# EAGLE design RTFM (EAGLE 9.3.2)
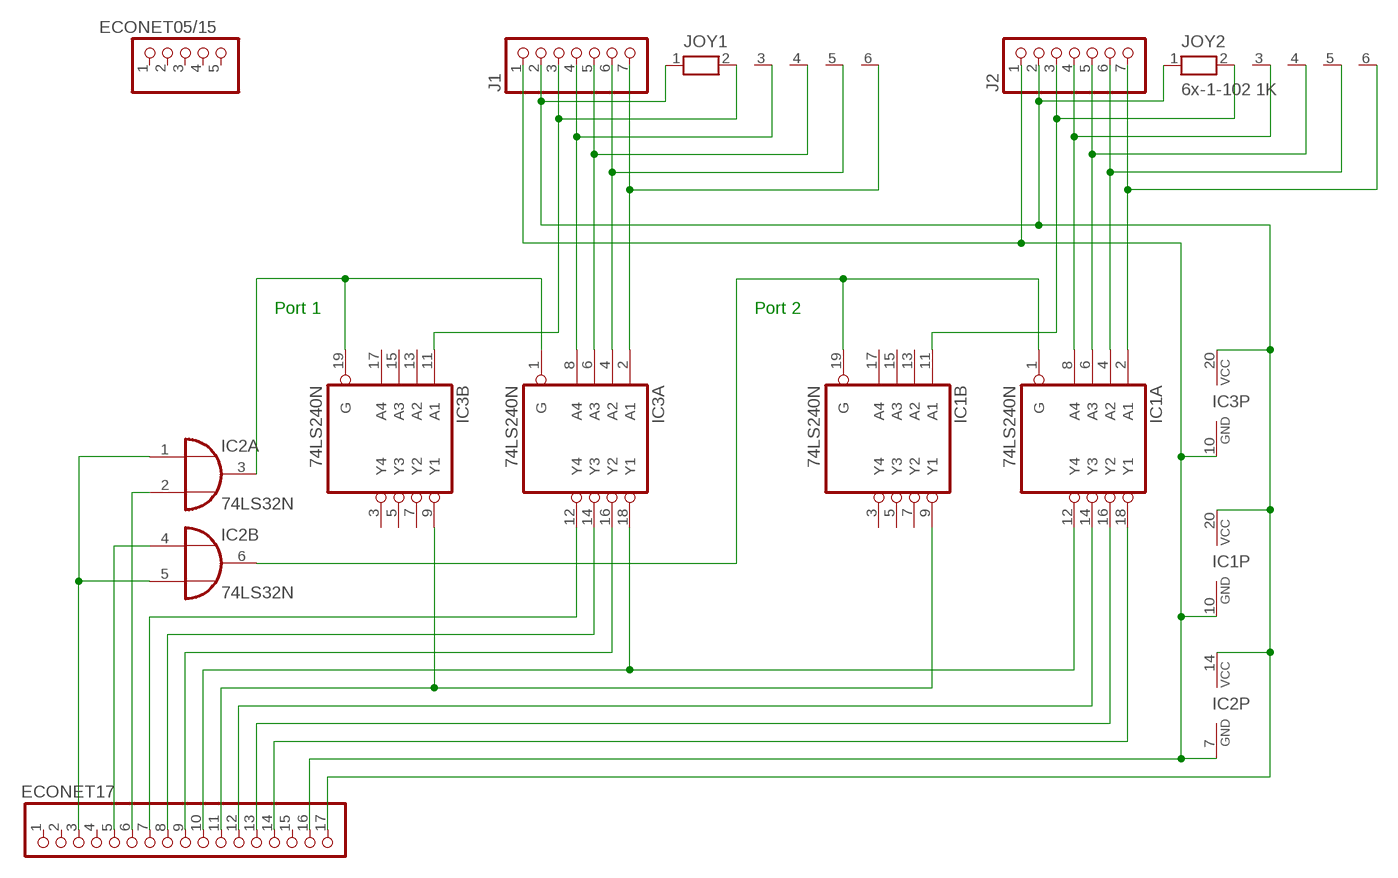
[diagram p0: schematic, sheet 1]

## Parts
ECONET05/15  PINHD-1X5  [1X05]
ECONET17  PINHD-1X17  [1X17]
IC1  74LS240N  [DIL20]
IC2  74LS32N  [DIL14]
IC3  74LS240N  [DIL20]
J1  PINHD-1X7  [1X07]
J2  PINHD-1X7  [1X07]
JOY1  6x-1-102 1K  RN05  [RN-6]
JOY2  6x-1-102 1K  RN05  [RN-6]

## Nets
N$1: ECONET17.3 IC2.1(A:I0) IC2.5(B:I1)
N$2: ECONET17.5 IC2.4(B:I0)
N$3: ECONET17.6 IC2.2(A:I1)
N$4: IC1.1(A:G) IC1.19(B:G) IC2.6(B:O)
N$5: ECONET17.16 IC1.10(P:GND) IC2.7(P:GND) IC3.10(P:GND) J1.1 J2.1
N$6: ECONET17.7 IC3.12(A:Y4)
N$7: ECONET17.8 IC3.14(A:Y3)
N$8: ECONET17.9 IC3.16(A:Y2)
N$9: ECONET17.10 IC1.12(A:Y4) IC3.18(A:Y1)
N$10: ECONET17.11 IC1.9(B:Y1) IC3.9(B:Y1)
N$11: ECONET17.12 IC1.14(A:Y3)
N$12: ECONET17.13 IC1.16(A:Y2)
N$13: ECONET17.14 IC1.18(A:Y1)
N$14: ECONET17.17 IC1.20(P:VCC) IC2.14(P:VCC) IC3.20(P:VCC) J1.2 J2.2 JOY1.1 JOY2.1
N$16: IC3.4(A:A2) J1.6 JOY1.5
N$17: IC3.6(A:A3) J1.5 JOY1.4
N$18: IC3.8(A:A4) J1.4 JOY1.3
N$19: IC3.2(A:A1) J1.7 JOY1.6
N$20: IC1.2(A:A1) J2.7 JOY2.6
N$21: IC1.4(A:A2) J2.6 JOY2.5
N$22: IC1.6(A:A3) J2.5 JOY2.4
N$23: IC1.8(A:A4) J2.4 JOY2.3
N$24: IC1.11(B:A1) J2.3 JOY2.2
N$25: IC2.3(A:O) IC3.1(A:G) IC3.19(B:G)
N$32: IC3.11(B:A1) J1.3 JOY1.2
Unconnected: ECONET05/15.1 ECONET05/15.2 ECONET05/15.3 ECONET05/15.4 ECONET05/15.5 ECONET17.1 ECONET17.2 ECONET17.4 ECONET17.15 IC1.3(B:Y4) IC1.5(B:Y3) IC1.7(B:Y2) IC1.13(B:A2) IC1.15(B:A3) IC1.17(B:A4) IC2.8(C:O) IC2.9(C:I0) IC2.10(C:I1) IC2.11(D:O) IC2.12(D:I0) IC2.13(D:I1) IC3.3(B:Y4) IC3.5(B:Y3) IC3.7(B:Y2) IC3.13(B:A2) IC3.15(B:A3) IC3.17(B:A4)

## Notes on the sheet
- Port 1 | Port 2

## Library data of the parts
ECONET05/15 = pinhead:PINHD-1X5: PIN HEADER
ECONET17 = pinhead:PINHD-1X17: PIN HEADER
IC1 IC3 = 74xx-eu:74*240: Octal BUFFER and LINE DRIVER, 3-state
IC2 = 74xx-eu:74*32: Quad 2-input OR gate
J1 J2 = pinhead:PINHD-1X7: PIN HEADER
JOY1 JOY2 = resistor-net:RN05: RESISTOR NETWORK; OC_FARNELL: unknown; OC_NEWARK: unknown

## Board
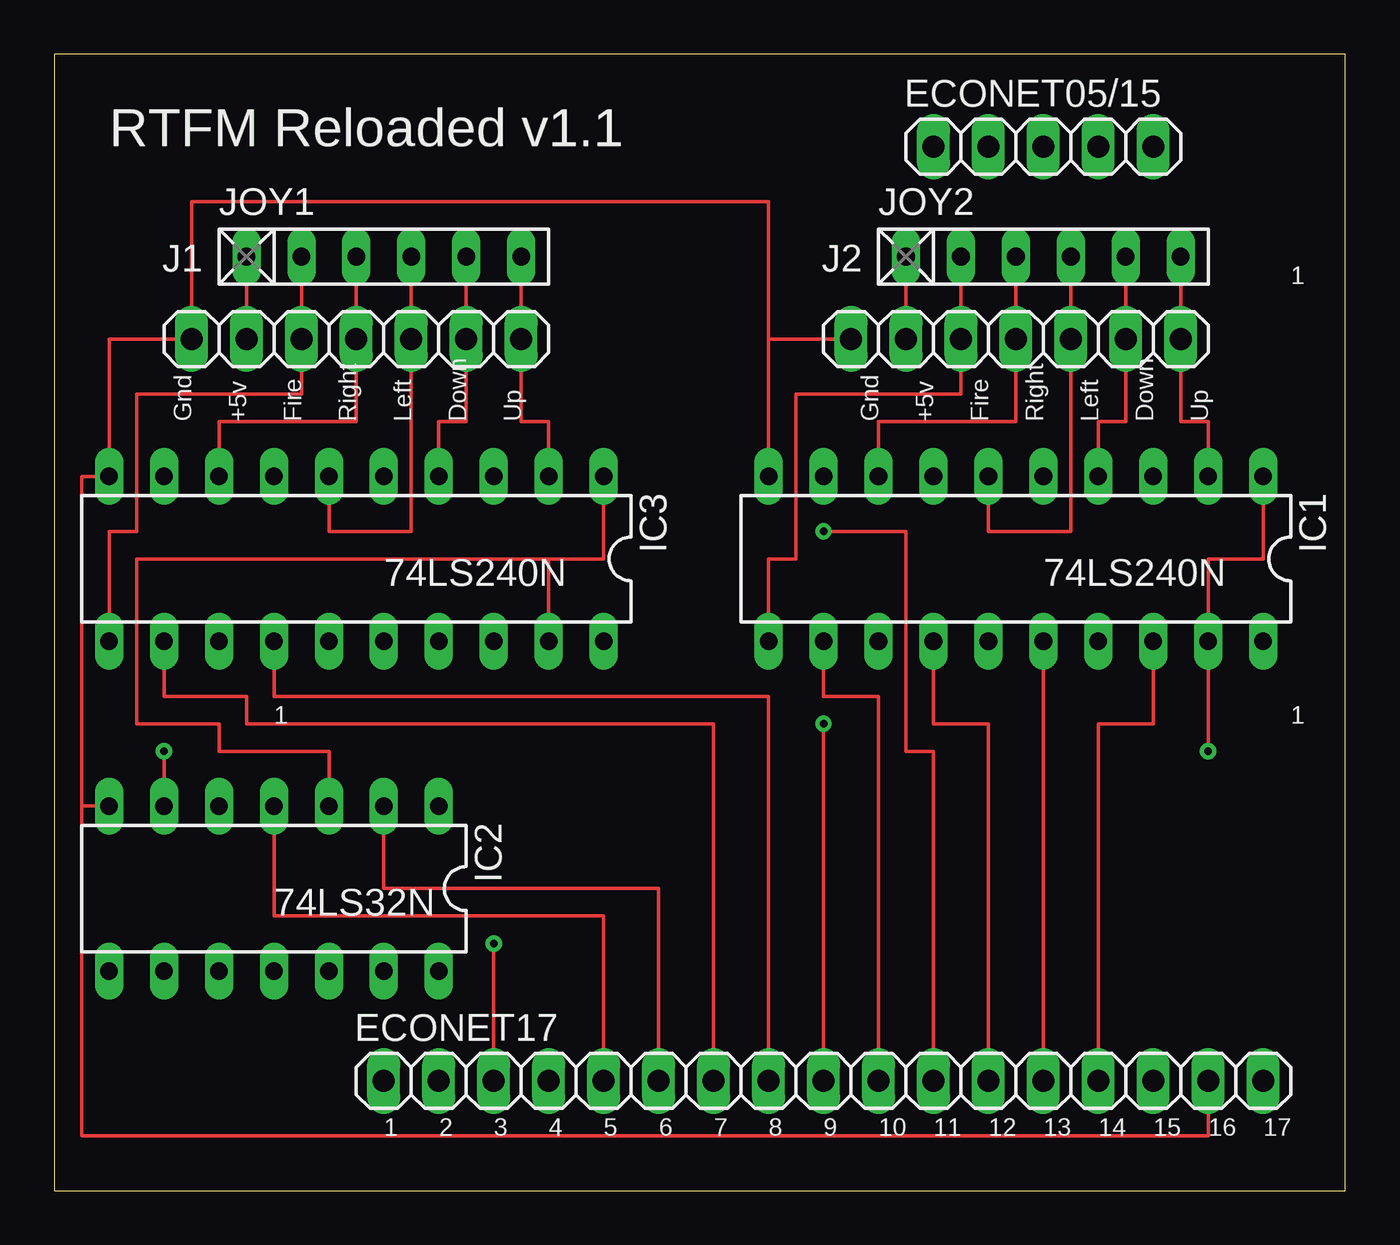
[diagram p1: board, top side]
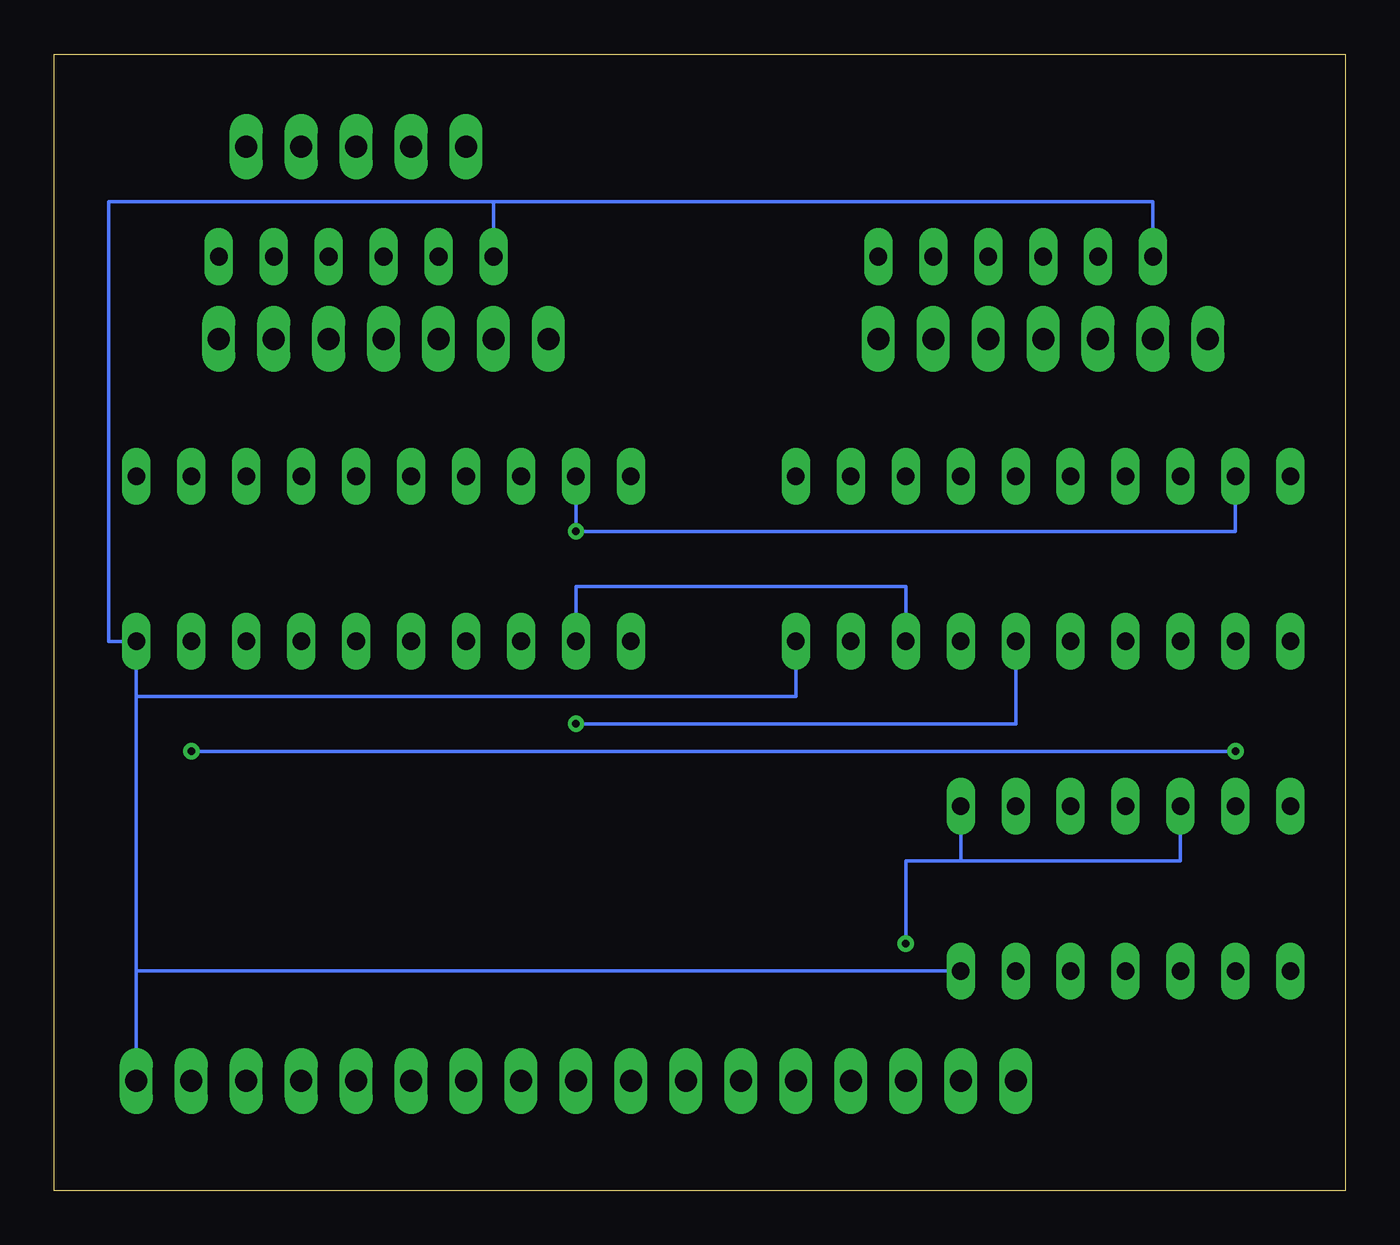
[diagram p2: board, bottom side, seen from below]

Size 59.68 x 52.54 mm. Coordinates in mm from the lower left corner, seen from the top.
Outline: 0,0 59.68,0 59.68,52.54 0,52.54 0,0
Copper layers (1*16): Top 0.035mm / dielectric 1.5mm / Bottom 0.035mm
Design rules "default": minimum track width 6mil, minimum drill 0.35mm, track to track 6mil, track to pad 6mil, pad to pad 6mil, via to via 6mil, smd to smd 6mil, copper to edge 40mil, drill to drill 6mil, minimum pad ring 10mil, minimum via ring 8mil, stop-mask expansion 4mil, vias tented up to drill 0mil, thermal gap 10mil

### Footprints (pad centres in the part's own frame; a part is rotated, then mirrored left to right if it is on the bottom)
1X05 = drill 1.016 long: 1 -5.08,0; 2 -2.54,0; 3 0,0; 4 2.54,0; 5 5.08,0
1X17 = drill 1.016 long: 1 -20.32,0; 2 -17.78,0; 3 -15.24,0; 4 -12.7,0; 5 -10.16,0; 6 -7.62,0; 7 -5.08,0; 8 -2.54,0; 9 0,0; 10 2.54,0; 11 5.08,0; 12 7.62,0; 13 10.16,0; 14 12.7,0; 15 15.24,0; 16 17.78,0; 17 20.32,0
DIL20 = drill 0.813 long: 1 -11.43,-3.81; 2 -8.89,-3.81; 3 -6.35,-3.81; 4 -3.81,-3.81; 5 -1.27,-3.81; 6 1.27,-3.81; 7 3.81,-3.81; 8 6.35,-3.81; 9 8.89,-3.81; 10 11.43,-3.81; 11 11.43,3.81; 12 8.89,3.81; 13 6.35,3.81; 14 3.81,3.81; 15 1.27,3.81; 16 -1.27,3.81; 17 -3.81,3.81; 18 -6.35,3.81; 19 -8.89,3.81; 20 -11.43,3.81
DIL14 = drill 0.813 long: 1 -7.62,-3.81; 2 -5.08,-3.81; 3 -2.54,-3.81; 4 0,-3.81; 5 2.54,-3.81; 6 5.08,-3.81; 7 7.62,-3.81; 8 7.62,3.81; 9 5.08,3.81; 10 2.54,3.81; 11 0,3.81; 12 -2.54,3.81; 13 -5.08,3.81; 14 -7.62,3.81
1X07 = drill 1.016 long: 1 -7.62,0; 2 -5.08,0; 3 -2.54,0; 4 0,0; 5 2.54,0; 6 5.08,0; 7 7.62,0
RN-6 = drill 0.813 long: 1 -6.35,0; 2 -3.81,0; 3 -1.27,0; 4 1.27,0; 5 3.81,0; 6 6.35,0

### Placement (x,y rotation side)
ECONET05/15  45.72,48.26 0 top
ECONET17  35.56,5.08 0 top
IC1  44.45,29.21 180 top
IC2  10.16,13.97 180 top
IC3  13.97,29.21 180 top
J1  13.97,39.37 0 top
J2  44.45,39.37 0 top
JOY1  15.24,43.18 0 top
JOY2  45.72,43.18 0 top

### Tracks (layer width: path | path; a pad name or v marks a point on that pad's centre or on a via)
N$1  (via drill 0.35)
  Top 0.152: ECONET17.3 v20.32,11.43
  Bottom 0.152: 17.78,15.24 20.32,15.24 v20.32,11.43 | 17.78,15.24 IC2.1 | IC2.5 7.62,15.24 17.78,15.24
N$2
  Top 0.152: ECONET17.5 25.4,12.7 10.16,12.7 IC2.4
N$3
  Top 0.152: ECONET17.6 27.94,13.97 15.24,13.97 IC2.2
N$4  (via drill 0.35)
  Top 0.152: IC1.1 55.88,29.21 53.34,29.21 IC1.19 v53.34,20.32 | IC2.6 v5.08,20.32
  Bottom 0.152: v5.08,20.32 v53.34,20.32
N$5
  Top 0.152: IC2.7 1.27,17.78 | 1.27,17.78 1.27,33.02 IC3.10 2.54,39.37 J1.1 6.35,45.72 33.02,45.72 33.02,39.37 | J2.1 33.02,39.37 | 33.02,39.37 IC1.10 | ECONET17.16 53.34,2.54 1.27,2.54 1.27,17.78
N$6
  Top 0.152: ECONET17.7 30.48,21.59 8.89,21.59 8.89,22.86 5.08,22.86 IC3.12
N$7
  Top 0.152: ECONET17.8 33.02,22.86 10.16,22.86 IC3.14
N$8  (via drill 0.35)
  Top 0.152: ECONET17.9 v35.56,21.59
  Bottom 0.152: v35.56,21.59 15.24,21.59 IC3.16
N$9
  Top 0.152: ECONET17.10 38.1,22.86 35.56,22.86 IC1.12
  Bottom 0.152: IC3.18 20.32,27.94 35.56,27.94 IC1.12
N$10  (via drill 0.35)
  Top 0.152: v35.56,30.48 39.37,30.48 39.37,20.32 40.64,20.32 ECONET17.11
  Bottom 0.152: IC3.9 5.08,30.48 v35.56,30.48 IC1.9
N$11
  Top 0.152: ECONET17.12 43.18,21.59 40.64,21.59 IC1.14
N$12
  Top 0.152: ECONET17.13 IC1.16
N$13
  Top 0.152: ECONET17.14 48.26,21.59 50.8,21.59 IC1.18
N$14
  Top 0.152: JOY1.1 J1.2 | JOY2.1 J2.2
  Bottom 0.152: 39.37,45.72 57.15,45.72 57.15,25.4 IC1.20 55.88,22.86 | IC2.14 55.88,10.16 ECONET17.17 55.88,22.86 | IC3.20 25.4,22.86 55.88,22.86 | JOY2.1 39.37,45.72 | 39.37,45.72 8.89,45.72 JOY1.1
N$16
  Top 0.152: JOY1.5 J1.6 19.05,35.56 17.78,35.56 IC3.4
N$17
  Top 0.152: JOY1.4 J1.5 16.51,30.48 12.7,30.48 IC3.6
N$18
  Top 0.152: JOY1.3 J1.4 13.97,35.56 7.62,35.56 IC3.8
N$19
  Top 0.152: JOY1.6 J1.7 21.59,35.56 22.86,35.56 IC3.2
N$20
  Top 0.152: JOY2.6 J2.7 | 52.07,38.1 J2.7 | IC1.2 53.34,35.56 52.07,35.56 J2.7
N$21
  Top 0.152: JOY2.5 J2.6 49.53,35.56 48.26,35.56 IC1.4
N$22
  Top 0.152: JOY2.4 J2.5 | J2.5 46.99,38.1 | IC1.6 43.18,30.48 46.99,30.48 J2.5
N$23
  Top 0.152: JOY2.3 J2.4 | 44.45,38.1 J2.4 | J2.4 44.45,35.56 38.1,35.56 IC1.8
N$24
  Top 0.152: JOY2.2 J2.3 41.91,36.83 34.29,36.83 34.29,29.21 33.02,29.21 IC1.11
N$25
  Top 0.152: IC3.1 25.4,29.21 22.86,29.21 | 22.86,29.21 IC3.19 | IC2.3 12.7,20.32 7.62,20.32 7.62,21.59 3.81,21.59 3.81,29.21 22.86,29.21
N$32
  Top 0.152: JOY1.2 J1.3 11.43,36.83 3.81,36.83 3.81,30.48 2.54,30.48 IC3.11

### Text on the board
tPlace: RTFM Reloaded v1.1 | 1 | Gnd | +5v | Fire | Right | Left | Down | Up | Gnd | +5v | Fire | Right | Left | Down | Up | 1 | 1 | 1 | 2 | 3 | 4 | 5 | 6 | 7 | 8 | 9 | 10 | 11 | 12 | 13 | 14 | 15 | 16 | 17
tNames: 74LS240N | 74LS240N | 74LS32N